# Altium project Picollo.PrjPcb
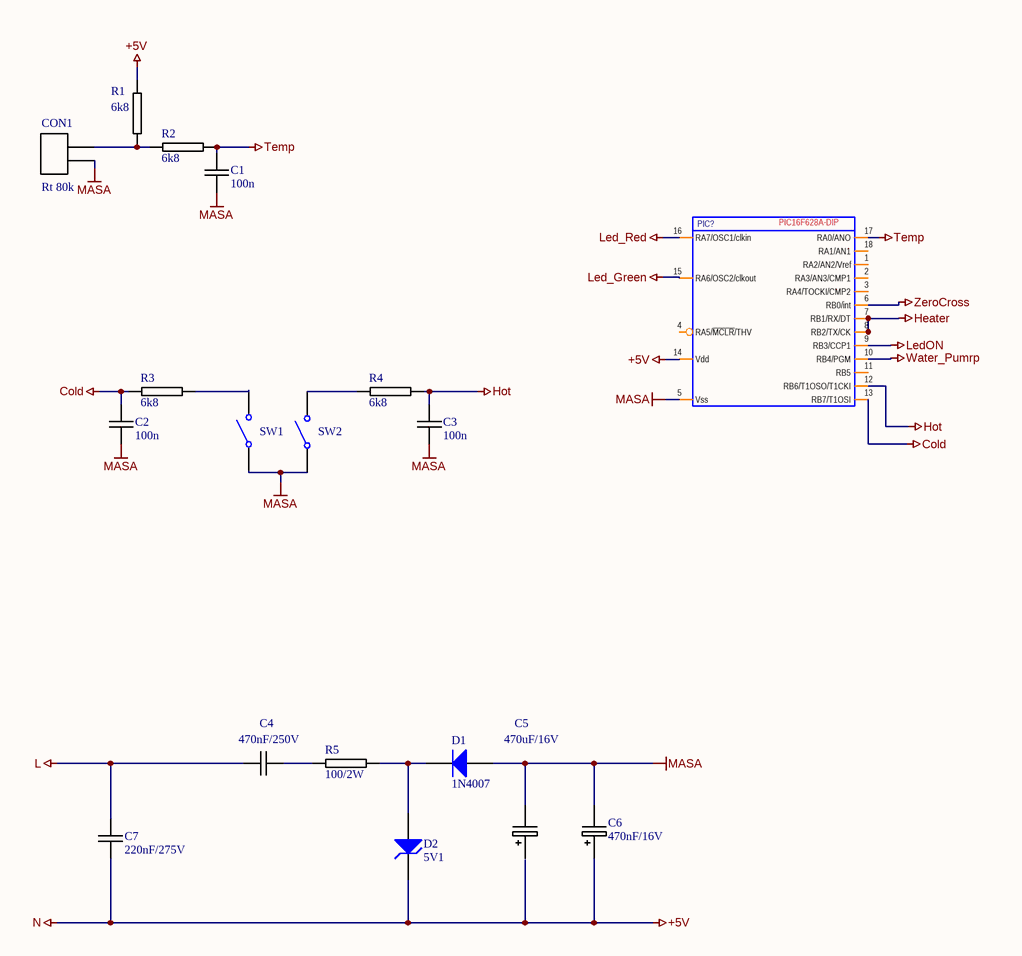
[diagram p0: Picollo.SCHDOC]
1 sheet, 18 parts. Net scope: global (net labels, ports and power ports of the same name join across sheets).

## Sheet Picollo.SCHDOC: KafePicollo
size 297 x 209 mm; Organization: OMEGA; DocumentNumber: 2024-0910; Revision: 1; SheetNumber: 1; SheetTotal: 1

### Parts
C1  100n  [RAD0.1]
C2  100n  [RAD0.1]
C3  100n  [RAD0.1]
C4  470nF/250V  [RAD0.1]
C5  470uF/16V  [CEA3.5/8/16]
C6  470nF/16V  [CEA3.5/8/16]
C7  220nF/275V  [RAD0.1]
CON1  Rt 80k  [SIP2]
D1  1N4007  [1N4148]
D2  BV: 5V1  (hidden comment: Zener Diode)
PIC?  PIC16F628A  [DIP18]  (value not drawn)
R1  6k8  [R125]
R2  6k8  [R125]
R3  6k8  [R125]
R4  6k8  [R125]
R5  100/2W  [R125]
SW1  Single-Pole, Single-Throw Switch  (value not drawn)
SW2  Single-Pole, Single-Throw Switch  (value not drawn)

### Nets
+5V: C6.1 C7.2 D2.2(K) PIC?.14(Vdd) R1.2  [also labelled N]
Cold: C2.1 PIC?.13(RB7/T1OSI) R3.2
Heater: PIC?.7(RB1/RX/DT) PIC?.8(RB2/TX/CK)
Hot: C3.1 PIC?.12(RB6/T1OSO/T1CKI) R4.1
L: C4.1 C7.1
Led_Green: PIC?.15(RA6/OSC2/clkout)
Led_Red: PIC?.16(RA7/OSC1/clkin)
LedON: PIC?.9(RB3/CCP1)
MASA: C1.2 C2.2 C3.2 C5.2 C6.2 CON1.1 D1.1(A) PIC?.5(Vss) SW1.1 SW2.1
Temp: C1.1 PIC?.17(RA0/ANO) R2.1
Water_Pumrp: PIC?.10(RB4/PGM)
ZeroCross: PIC?.6(RB0/int)
NetC4_2: C4.2 R5.2
NetCON1_2: CON1.2 R1.1 R2.2
NetD1_2: D1.2(K) D2.1(A) R5.1
NetR3_1: R3.1 SW1.2
NetR4_2: R4.2 SW2.2

Not connected (* = marked no-connect by the designer): C5 1; PIC? 1(RA2/AN2/Vref) 2(RA3/AN3/CMP1) 3(RA4/TOCKI/CMP2) 4(RA5/~{MCLR}/THV) 11(RB5) 18(RA1/AN1)

### Notes on the sheet
- THIS DOCUMENT AND THE DATA DISCLOSED HEREIN OR
- HEREWITH IS THE PROPERTY OF ALTIUM LIMITED AND MAY
- DWG NO:
- REVISION
- REV:
- DESCRIPTION
- DATE
- APPROVED
- BE FREELY DISTRIBUTED IN WHOLE. NO RIGHTS ARE
- RESERVED OR EXPRESS OR IMPLIED WARANTEE GIVEN.
- ENG:
- APPROVALS
- PROJECT
- DSN:
- CHK:
- REFERENCE DOCUMENTS
- PROJECT REVISION:
- TITLE
- DOCUMENT REVISION:
- DESIGN ITEM:
- BOM:
- FAB DWG:
- PCB DWG:
- ASSY DWG:
- SCALE:
- A3
- SIZE
- CAGE CODE
- FILE NAME
- DWG NO.
- SHEET
- OF
- REV
- (in symbol PIC16F628A) PIC16F628A-DIP

### Library data of the parts
C1-C4 C7 = CAP
C5 C6 = ELECTRO1: Part Field 1: *; Part Field 2: *; Part Field 3: *; Part Field 4: *; Part Field 5: *; Part Field 6: *; Part Field 7: *; Part Field 8: *; Part Field 9: *; Part Field 10: *; Part Field 11: *; Part Field 12: *; Part Field 13: *; Part Field 14: *; Part Field 15: *; Part Field 16: *
CON1 = 2PIN
D1 = Diode: Default Diode; Published: 8-Jun-2000; LatestRevisionDate: 17-Jul-2002; LatestRevisionNote: Re-released for DXP Platform.; PackageVersion: Sep-1996; PackageReference: SMC; Publisher: Altium Limited; PackageDescription: DO-214-AB/SMC; 2 C-Bend Leads; Body 7.9 x 5.9 mm, inc. leads (LxW); Code_JEDEC: DO-214-AB
D2 = Zener Diode: AF: 1; BV_MAX: 1e99; CJO: 0; EG: 1.11; FC: 0.5; IBV: 0.001; IS: 1e-14; MJSW: 0.33; NTUN: 30; TNOM: 27; XTI: 3; SimulationGenericComponent: True; CJP: 0; CTA: 0; CTP: 0; FCS: 0.5; FV_MAX: 1e99; IKF: 0; IKR: 0; ISR: 1e-14; JSW: 0; JTUN: 0; JTUNSW: 0; KEG: 1; KF: 0; LEVEL: 1; N: 1; NBV: 1; NR: 1; NS: 1; PHP: 1; RS: 0; TCV: 0; TLEV: 0; TLEVC: 0; TM1: 0; TM2: 0; TPB: 0; TPHP: 0; TRS: 0; TRS2: 0; TT: 0; TTT1: 0; TTT2: 0; VJ: 1; XTITUN: 3
PIC? = PIC16F628A: *; Note: Microcontroller; Temp.Characteristic: -40C to +85C; Value: *; ComponentLink1URL: *; ComponentLink2URL: *; Dealer Digi-Key: *; Dealer Аlternative: *; PartNumber Digi-Key: *; Pricing Digi-Key: *; Pricing LCSC: *; Website developer: http://catcatcat.d-lan.dp.ua/; Publisher: Catcatcat Electronics; Assembly type: Basic Extended Part
R1-R5 = RES2
SW1 SW2 = SPST SW: closed: 0; Rclosed: 1m; Ropen: 1Meg; SimulationGenericComponent: True